# Altium schematic sheet DesignProject2.SchDoc
size A; SheetNumber: 1; SheetTotal: 1
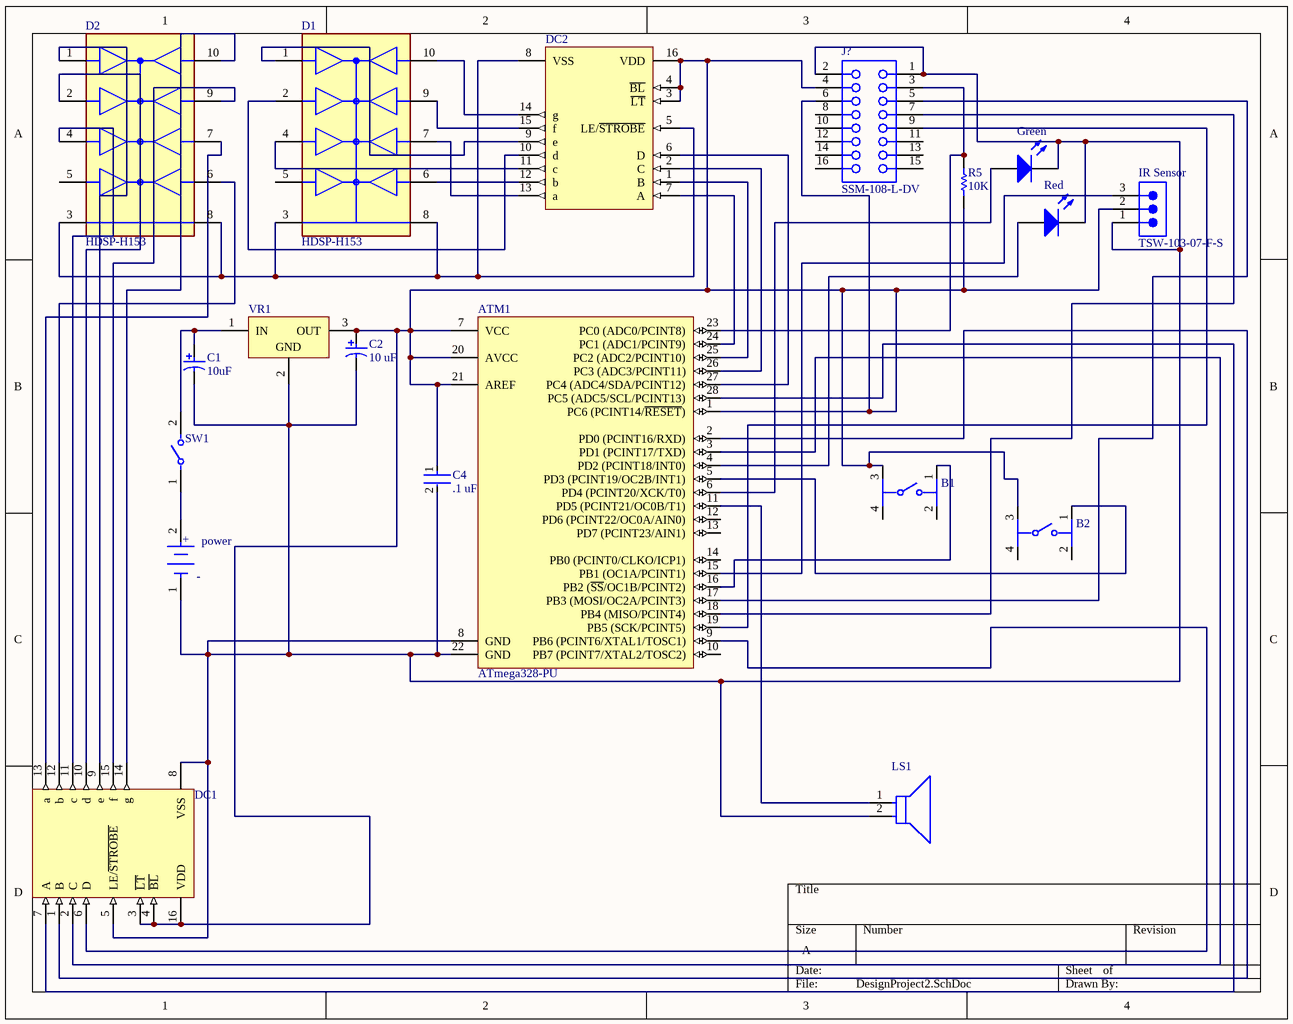
[diagram p0: DesignProject2.SchDoc]

## Parts
ATM1  ATmega328-PU  [28P3]
B1  (no value)  [FP-PTS645SM43SMTR92LFS-MFG]
B2  (no value)  [FP-PTS645SM43SMTR92LFS-MFG]
C1  10uF  [PNSC-EEU-EE2G100-2_V]
C2  10 uF  [CAPPR55-200-1100X500X1200]
C4  .1 uF  [FP-RDE5E1+0_5-4-MFG]
D1  HDSP-H153  [FP-HDSP-H153-MFG]
D2  HDSP-H153  [FP-HDSP-H153-MFG]
DC1  (no value)  [N0016A]
DC2  (no value)  [N0016A]
Green  (no value)  [VISH-TSAL6200]
IR_Sensor  TSW-103-07-F-S  [SMTC-TSW-103-07-X-S]
J?  SSM-108-L-DV  [SMTC-SSM-108-X-DV]
LS1  (no value)  [FP-CVS-1508-MFG]
power  (no value)  [FP-BH9VPC-MFG]
R5  10K  [OMTE-RES7X2.5-2]
Red  (no value)  [VISH-TSAL6200]
SW1  (no value)  [FP-A6S-1104-H-MFG]
VR1  (no value)  [TO220]

## Nets
NetATM1_1: ATM1.1(PC6_(PCINT14/~{RESET})) ATM1.7(VCC) ATM1.20(AVCC) ATM1.21(AREF) B1.3 B2.3 C2.1 C4.1 DC1.3(~{LT}) DC1.4(~{BL}) DC1.16(VDD) DC2.3(~{LT}) DC2.4(~{BL}) DC2.16(VDD) IR_Sensor.2 J?.4 J?.6 R5.1 VR1.3(OUT)
NetATM1_2: ATM1.2(PD0_(PCINT16/RXD)) DC1.1(B)
NetATM1_3: ATM1.3(PD1_(PCINT17/TXD)) DC1.2(C)
NetATM1_4: ATM1.4(PD2_(PCINT18/INT0)) Red.1(A)
NetATM1_5: ATM1.5(PD3_(PCINT19/OC2B/INT1)) B2.1
NetATM1_6: ATM1.6(PD4_(PCINT20/XCK/T0)) Green.1(A)
NetATM1_8: ATM1.8(GND) ATM1.22(GND) C1.2 C2.2 C4.2 DC1.5(LE/~{STROBE}) DC1.8(VSS) Green.2(K) IR_Sensor.1 J?.1 J?.2 LS1.2(A) power.1(C) Red.2(K) VR1.2(GND)
NetATM1_9: ATM1.9(PB6_(PCINT6/XTAL1/TOSC1)) DC1.6(D)
NetATM1_11: ATM1.11(PD5_(PCINT21/OC0B/T1)) LS1.1(C)
NetATM1_15: ATM1.15(PB1_(OC1A/PCINT1)) IR_Sensor.3
NetATM1_16: ATM1.16(PB2_(~{SS}/OC1B/PCINT2)) B1.1
NetATM1_17: ATM1.17(PB3_(MOSI/OC2A/PCINT3)) J?.5
NetATM1_18: ATM1.18(PB4_(MISO/PCINT4)) J?.7
NetATM1_19: ATM1.19(PB5_(SCK/PCINT5)) J?.9
NetATM1_23: ATM1.23(PC0_(ADC0/PCINT8)) J?.3 R5.2
NetATM1_24: ATM1.24(PC1_(ADC1/PCINT9)) DC2.7(A)
NetATM1_25: ATM1.25(PC2_(ADC2/PCINT10)) DC2.1(B)
NetATM1_26: ATM1.26(PC3_(ADC3/PCINT11)) DC2.2(C)
NetATM1_27: ATM1.27(PC4_(ADC4/SDA/PCINT12)) DC2.6(D)
NetATM1_28: ATM1.28(PC5_(ADC5/SCL/PCINT13)) DC1.7(A)
NetC1_1: C1.1 SW1.2 VR1.1(IN)
NetD1_1: D1.1(ANODE_e) DC2.9(e)
NetD1_2: D1.2(ANODE_d) DC2.10(d)
NetD1_3: D1.3(C) D1.8(C) D2.3(C) D2.8(C) DC2.5(LE/~{STROBE}) DC2.8(VSS)
NetD1_4: D1.4(ANODE_c) DC2.11(c)
NetD1_6: D1.6(ANODE_b) DC2.12(b)
NetD1_7: D1.7(ANODE_a) DC2.13(a)
NetD1_9: D1.9(ANODE_f) DC2.15(f)
NetD1_10: D1.10(ANODE_g) DC2.14(g)
NetD2_1: D2.1(ANODE_e) DC1.9(e)
NetD2_2: D2.2(ANODE_d) DC1.10(d)
NetD2_4: D2.4(ANODE_c) DC1.11(c)
NetD2_6: D2.6(ANODE_b) DC1.12(b)
NetD2_7: D2.7(ANODE_a) DC1.13(a)
NetD2_9: D2.9(ANODE_f) DC1.15(f)
NetD2_10: D2.10(ANODE_g) DC1.14(g)
Netpower_2: power.2(A) SW1.1

Not connected (* = marked no-connect by the designer): ATM1 10(PB7_(PCINT7/XTAL2/TOSC2)) 12(PD6_(PCINT22/OC0A/AIN0)) 13(PD7_(PCINT23/AIN1)) 14(PB0_(PCINT0/CLKO/ICP1)); B1 2 4; B2 2 4; D1 5(ANODE_DP); D2 5(ANODE_DP); J? 8 10 11 12 13 14 15 16

## Notes on the sheet
- (in symbol CMP-136216-000001-1) +; -

## Library data of the parts
ATM1 = CMP-0095-00015-2: 8-bit AVR Microcontroller, 32KB Flash, 1KB EEPROM, 2KB SRAM, 28-pin PDIP, Industrial Grade (-40°C to 85°C); ComponentLink3Description: ATmega48A/48PA/88A/88PA/168A/168PA/328/328P Summary; RevisionNote: DatasheetVersion updated. URLs added.; DatasheetVersion: revD, May-2011; ComponentLink1URL: http://www.atmel.com/; PackageVersion: revB, Sep-2001; PackageDescription: 28-lead (0.300"/7.62mm Wide) Plastic Dual Inline Package (PDIP); PackageReference: 28P3; ComponentLink1Description: Manufacturer URL; ComponentLink2Description: ATmega48A/48PA/88A/88PA/168A/168PA/328/328P Datasheet; ComponentLink3URL: http://www.atmel.com/dyn/resources/prod_documents/8271S.pdf; ComponentLink2URL: http://www.atmel.com/dyn/resources/prod_documents/8271.pdf
B1 B2 = CMP-2000-05160-2: SWITCH TACTILE SPST-NO 0.05A 12V; Contact Resistance: 100mR; Throw Configuration: SPST; Illumination Type: Non-Illuminated; Mechanical Life: 100000Cycles; Current Rating: 50mA; Switch Function: Off-Mom; Actuator Length: 0.85mm; Actuator Material: Nylon; Actuator Type: Standard; Operating Force: 160gf; Min Operating Temperature: -20°C; REACH SVHC: No SVHC; Termination: Gull Wing; Case/Package: SMD/SMT; Packaging: Tape and Reel; Mount: Surface Mount; Voltage Rating (DC): 12V; Orientation: Straight; Lead Free: Lead Free; Contact Material: Silver; Color: Black; Max Current Rating: 50mA; Contact Plating: Silver; Depth: 9mm; Package Quantity: 1; Max Voltage Rating (DC): 12V; Length: 6mm; Max Operating Temperature: 60°C
C1 = CMP-0736-00002-1: Aluminum Electrolytic Capacitor, 10 uF +/- 20%, 400 V, -25 to 105 degC, 2-Pin 10 x 10 x 22 mm Through-hole, RoHS, Tape and Reel; PartNumber: EEU-EE2G100; Manufacturer: Panasonic; Ripple Current: 430 mA; Rated Voltage: 400 V; Capacitance Tolerance: +/- 20%; ComponentLink2URL: http://industrial.panasonic.com/www-data/pdf/ABA0000/ABA0000CE113.pdf; Mounting Technology: Through Hole; PackageVersion: Nov-12; ComponentLink3URL: http://industrial.panasonic.com/www-data/pdf/ABA0000/ABA0000PE245.pdf; ComponentLink2Description: Datasheet; DatasheetVersion: Nov-12; PackageDescription: 2-Pin Through-hole, Base 10 x 10 mm, Height 22 mm; PackageReference: EEU-EE2G100-2; ComponentLink1URL: http://industrial.panasonic.com/; Temp. Range: -25 to 105 degC; RoHS: TRUE; Packing: Tape and Reel; Cap.: 10 uF; ComponentLink1Description: Manufacturer URL; ComponentLink3Description: Package Specification
C2 = CMP-1665-00038-2: Aluminum Electrolytic Capacitor, 10 uF, +/- 20%, 50 V, -40 to 85 degC, 2-Pin THD, RoHS, Bulk; Manufacturer: Panasonic; Life (Hours): 2000Hour; Lead/Base Style: Straight; Dissipation Factor: 0.12%; Capacitance: 10uF; Leakage Current: 3uA; Dielectric Material: Aluminium; Lead Diameter: 0.5mm; Voltage Rating: 50V; Ripple Current: 65mA; Package Reference: CAPPR55-200-1100X500X1200; Height: 11mm; Diameter: 5mm; REACH SVHC: NoSVHC; Mount: ThroughHole; Packaging: Bulk; Manufacturer URL: http://www.panasonic.com/; Termination: Radial; Datasheet URL: https://industrial.panasonic.com/cdbs/www-data/pdf/RDF0000/ABA0000C1218.pdf; Lead Free: LeadFree; Height - Seated (Max): 0.472inch; Case/Package: Radial; Package Description: 2-Pin Radial Lead, Dia 5 mm, Height 12 mm; Tolerance: 20%; Datasheet Version: Rev. 05, 10/2016; Package Quantity: 200; Ripple Current (AC): 65mA; Min Operating Temperature: -40degC; RoHSCompliant: true; Number of Pins: 2; Max Operating Temperature: 85degC; Voltage: 50V; Lead Pitch: 2mm; Radiation Hardening: No; Voltage Rating (DC): 50V; Length: 11mm
C4 = CMP-06035-060479-1: Ceramic Capacitor 100nF ±10% 1kV X7R Radial; Lead/Base Style: Straight; Lead Diameter: 0.5mm; Lead Pitch: 0.197inch; Case/Package: Radial; Voltage Rating: 1kV; Lead Free: Lead Free; Package Quantity: 1; Capacitance: 100nF; Height - Seated (Max): 0.315inch; Termination: Radial; Dielectric: X7R; Width: 0.157inch; Tolerance: 10%; Resistor Type: Ceramic; Packaging: Tape and Reel; Length: 0.295inch; Max Operating Temperature: 125°C; Height: 8mm; Voltage Rating (DC): 1kV; Mount: Through Hole; Min Operating Temperature: -55°C
D1 D2 = CMP-18395-000002-1: LED 7-SEG 14.2MM CC RED RHD RHD; Manufacturer: Broadcom; Wavelength: 637nm; Power Dissipation: 96mW; Standoff Height: 1.14mm; Luminous Intensity: 16mcd; Test Current: 100mA; Element Config: Common Cathode; Reverse Voltage: 15V; Viewing Angle: 100°; Forward Voltage: 2V; Device Class L2: Displays; Temperature Range High: +100°C; ComponentLink2Description: Datasheet; Device Class L3: LED Displays; Automotive: No; Digikey Description: LED 7-SEG 14.2MM CC RED RHD RHD; Display Type: LED; Lead Free: Yes; Category: Disp; Package: HDSP-H153; Height: 8mm; Octopart: https://octopart.com/hdsp-h153-broadcom-71129578; RoHS: TRUE; Device Class L1: Optoelectronics; Manufacturer Part Number: HDSP-H153; Temperature: -20°C to +100°C; ComponentLink2URL: https://docs.broadcom.com/docs/AV02-1107EN; Forward Current: 100mA; Temperature Range Low: -20°C
DC1 DC2 = CMP-0388-00316-2: CMOS BCD-to-7-Segment LED Latch / Decoder / Driver, 3 to 18 V, -55 to 125 degC, 16-pin DIP (N16), Pb-Free (RoHS); PartNumber: CD4511BE; Manufacturer: Texas Instruments; Vin(Max)(V): 18; Vin(Min)(V): 3; SubFamily: Discrete Segment LED Driver; Rating: Military; PackageDescription: 16-Pin Plastic In-Line, Body 19.305 x 6.35 mm, Pitch 2.54 mm; ComponentLink2Description: Datasheet; Code_JEDEC: MS-001; ComponentLink1Description: Manufacturer URL; PackageReference: N0016A; DatasheetVersion: SCHS072B; ComponentLink1URL: http://www.ti.com/; Mounting Technology: Through Hole; PackageVersion: 4040049/E; Eco-Plan: Pb-Free (RoHS); ComponentLink3URL: http://www.ti.com/litv/pdf/mpdi002c; ComponentLink2URL: http://www.ti.com/general/docs/lit/getliterature.tsp?genericPartNumber=CD4511B&fileType=pdf; ComponentLink3Description: Package Specification
Green Red = CMP-2000-07327-1: High Power Infrared Emitting Diode, GaAlAs, MQW, 1.35 V, 100 mA, -40 to 85 degC, 2-Pin THD, RoHS, Bulk; Manufacturer: Vishay; Lum Intensity: 500mW/srmcd; Product Depth (mm): 5.8mm; Luminous Intensity: 500mW/sr; Forward Voltage: 3V; Main Category: IrLED; Shape Type: Circular; Peak Wavelength: 950nm; Rad Hardened: No; Product Height (mm): 8.7mm; Number of  Elements: 1; Forward Current: 100mA; High Brightness: Yes; Reverse Voltage: 5V; DELETED: Compliant; Power Dissipation: 160W; Viewing Angle: 34deg; Lens Type: Colored; Packaging: Bulk; Lens Dimensions: 5x5x7.7mm; Type: IrLED; Package Reference: TSAL6200; Chip Material: GaAlAs; Package Description: 2-Pin Through Hole Device, Dia 5.8 mm, Pitch 2.54 mm; Manufacturer URL: http://www.vishay.com/; Product Length (mm): 5.8mm; Datasheet URL: http://www.vishay.com/docs/81010/tsal6200.pdf; Operating Temperature Classification: Industrial; Package Type: T-13/4; Pin Count: 2; Mounting: ThroughHole; Mounting Technology: ThroughHole; Test Current (It): 100mA; Datasheet Version: Rev. 2.4, 03/2014; Operating Temp Range: -40Cto85C
IR_Sensor = CMP-1024-00331-1: 0.025" SQ Post Header, Through-hole, Vertical, -55 to 125 degC, 2.54 mm Pitch, 3-Pin, Male, RoHS; Manufacturer: Samtec; Pitch: 2.54 mm; DatasheetVersion: F-214; ComponentLink1Description: Manufacturer URL; ComponentLink3URL: http://www.samtec.com/documents/webfiles/cpdf/TSW-XXX-XX-XXX-X-XX-XXX-MKT.pdf; Mounting Technology: Through-hole; PackageDescription: .025[0.64] SQ. Post Terminal Strip Assembly; Temperature Range: -55 to 125 degC; ComponentLink3Description: Package Specification; Orientation: Vertical; PartNumber: TSW-103-07-F-S; RoHS: True; PackageVersion: DM, 8/1988; ComponentLink2Description: Datasheet; ComponentLink1URL: http://www.samtec.com; ComponentLink2URL: http://www.samtec.com/documents/webfiles/pdf/TSW_TH.PDF; PackageReference: TSW-103-07-X-S
J? = CMP-1023-00226-1: Tiger Claw(TM) Surface Mount Socket, Vertical, -55 to 125 degC, 2.54 mm Pitch, 16-Pin, Female, RoHS; Manufacturer: Samtec; Pitch: 2.54 mm; ComponentLink1URL: http://www.samtec.com; Temperature Range: -55 to 125 degC; PackageDescription: .100 C.L. Double Vertical SMT Socket Strip; DatasheetVersion: F-214; ComponentLink3Description: Package Specification; Orientation: Vertical; ComponentLink1Description: Manufacturer URL; PartNumber: SSM-108-L-DV; ComponentLink2Description: Datasheet; RoHS: True; PackageVersion: AK, 3/2000; ComponentLink3URL: http://www.samtec.com/documents/webfiles/cpdf/SSM-1XX-XXX-DV-XX-XX-X-XX-MKT.pdf; Mounting Technology: Surface Mount; ComponentLink2URL: http://www.samtec.com/documents/webfiles/pdf/SSM_SM.PDF; PackageReference: SSM-108-X-DV
LS1 = CMP-14846-000001-1: SPEAKER 8OHM 300MW TOP PORT 87DB; Manufacturer: CUI Inc; Resistance: 8Ω; Value: 8Ω; Frequency: 1700Hz; Package: CVS-1508; Device Class L1: Electromechanical; Manufacturer Part Number: CVS-1508; Mouser Description: Speakers & Transducers Speakers; Temperature Range High: +55°C; Octopart: https://octopart.com/cvs-1508-cui-21325683; Device Class L2: Audio Products; Temperature Range Low: -20°C; Category: Speak; Digikey Description: SPEAKER 8OHM 300MW TOP PORT 87DB; Temperature: -20°C to +55°C; Height: 8mm; ComponentLink2Description: Datasheet; ComponentLink2URL: https://www.cui.com/product/resource/cvs-1508.pdf; Device Class L3: Speakers; Lead Free: Yes; RoHS: TRUE; Automotive: No
power = CMP-136216-000001-1: BATTERY HOLDER 9V PC PIN; Manufacturer Part Number: BH9VPC; Manufacturer: Memory Protection Devices; Conn Orientation: Vertical; Is Female: yes; Number Of Contacts: 2; Device Class L2: unset; Contact Material: Nickel; Device Class L1: Connectors; Lead Free: Yes; Digikey Description: BATTERY HOLDER 9V PC PIN; Category: Batt; ComponentLink2URL: http://www.memoryprotectiondevices.com/datasheets/BH9VPC-datasheet.pdf; Device Class L3: unset; Package: 0; Automotive: No; ComponentLink2Description: Datasheet; Height: 21.12mm; Voltage Rating: 9V; Octopart: https://octopart.com/bh9vpc-memory+protection+devices-22788154; RoHS: TRUE
R5 = CMP-2000-06865-1: Little Demon(R) Carbon Composition Molded OD Series, 250 V, 10 KOhm, +/-5%, -70 to 130 degC, 2-Pin THD, RoHS, Bulk; PartNumber: OD103JE; Manufacturer: Ohmite; Power Rating: 0.25W; Power (Watts): 0.25W,1/4W; Tolerance: ±5%; Online Catalog: OD,OF,OASeries,LittleDemon®; Catalog Drawings: OD,OF,OASeries; EDA / CAD Models: DownloadfromAcceleratedDesigns; Mounting Technology: ThroughHole; Datasheet Version: 06/2016; RoHS Information: LittleDemon"E"SeriesMaterialDeclaration; Number of Terminations: 2; Temperature Coefficient: -; Height: -; Resistance (Ohms): 10k; Composition: CarbonComposition; Package Description: 2-Pin THD Resistor, Body 7 x 2.5 mm, Lead Dia. 0.6 mm; Size / Dimension: 0.098"Diax0.276"L(2.50mmx7.00mm); Category: Resistors; Manufacturer URL: http://www.ohmite.com/; Features: PulseWithstanding; Family: ThroughHoleResistors; Supplier Device Package: Axial; Package / Case: Axial; Standard Package: 100; Package Reference: RES7X2.5; Operating Temperature: -; Series: LittleDemon®OD; Datasheet URL: http://www.ohmite.com/cat/res_od_of_oa.pdf; Packaging: Bulk
SW1 = CMP-08827-000005-1: SWITCH SLIDE DIP SPST 25MA 24V; Manufacturer Part Number: A6S-1104-H; Manufacturer: Omron Electronics Inc-EMC Div; Throw Configuration: SPST-NO; Standoff Height: 0mm; Number Of Circuits: 1; Electromechanical Life: 1000Cycles; Contact Resistance: 200mΩ; Digikey Description: SWITCH SLIDE DIP SPST 25MA 24V; ComponentLink2Description: Datasheet; Mount: Surface Mount; ComponentLink2URL: https://omronfs.omron.com/en_US/ecb/products/pdf/en-a6s.pdf; Category: Switch; Height: 3.95mm; Device Class L3: DIP Switches; Octopart: https://octopart.com/a6s-1104-h-omron-55410938; Mouser Description: DIP Switches / SIP Switches Dip Switch; Lead Free: Yes; Temperature Range Low: -20°C; Temperature Range High: +70°C; Automotive: No; Ambient Temperature Range Low: -20°C; Ambient Temperature Range High: +70°C; Voltage Rating Dc: 24V; Device Class L2: Switches; RoHS: TRUE; Package: 0; Contact Current Rating: 25mA; Device Class L1: Electromechanical; Temperature: -20°C to +70°C
VR1 = CMP-0244-00483-1: Positive Voltage Regulator, 5V, 3-Pin TO-220; PackageDescription: TO, Thru-Hole, Vertical, Heatsink Mounted; 3 In-Line Leads; Pitch 2.54 mm; ComponentLink2Description: Datasheet; PackageReference: TO220; ComponentLink3URL: http://www.st.com/internet/com/TECHNICAL_RESOURCES/TECHNICAL_LITERATURE/PACKAGE_INFORMATION/CD00004649.pdf; DatasheetVersion: 16/11/2011; ComponentLink1Description: Manufacturer URL; ComponentLink1URL: http://www.st.com; PackageVersion: ver3.0; ComponentLink3Description: Package Specification; ComponentLink2URL: http://www.st.com/internet/com/TECHNICAL_RESOURCES/TECHNICAL_LITERATURE/DATASHEET/CD00000444.pdf